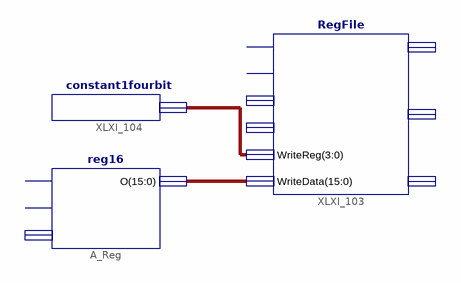
[diagram p0: schematic sheet 1]
// Xilinx ISE schematic lacc.sch (spartan3adsp) as structural Verilog: 3 symbols, 0 ports
module lacc (
);

  wire [3:0] XLXN_3;
  wire [15:0] XLXN_1;

  reg16 A_Reg (.O(XLXN_1));  // open: CLK, Write, I
  RegFile XLXI_103 (.WriteReg(XLXN_3), .WriteData(XLXN_1));  // open: RegWrite, clock, Read1, Read2, Data1, Data2, Data3
  constant1fourbit XLXI_104 (.O(XLXN_3));
endmodule
